# Altium schematic sheet Longboard_32bit.SchDoc: RP2040 CNC
size C; Author: AM; CompanyName: Expatria Technologies; DrawnBy: A.Marles; Engineer: AM; Organization: Expatria Technolgoies; Address1: PO Box 2084; Address3: Merritt, BC V1K 1B8; Address4: Canada; DocumentNumber: 4; SheetNumber: 4; SheetTotal: 26
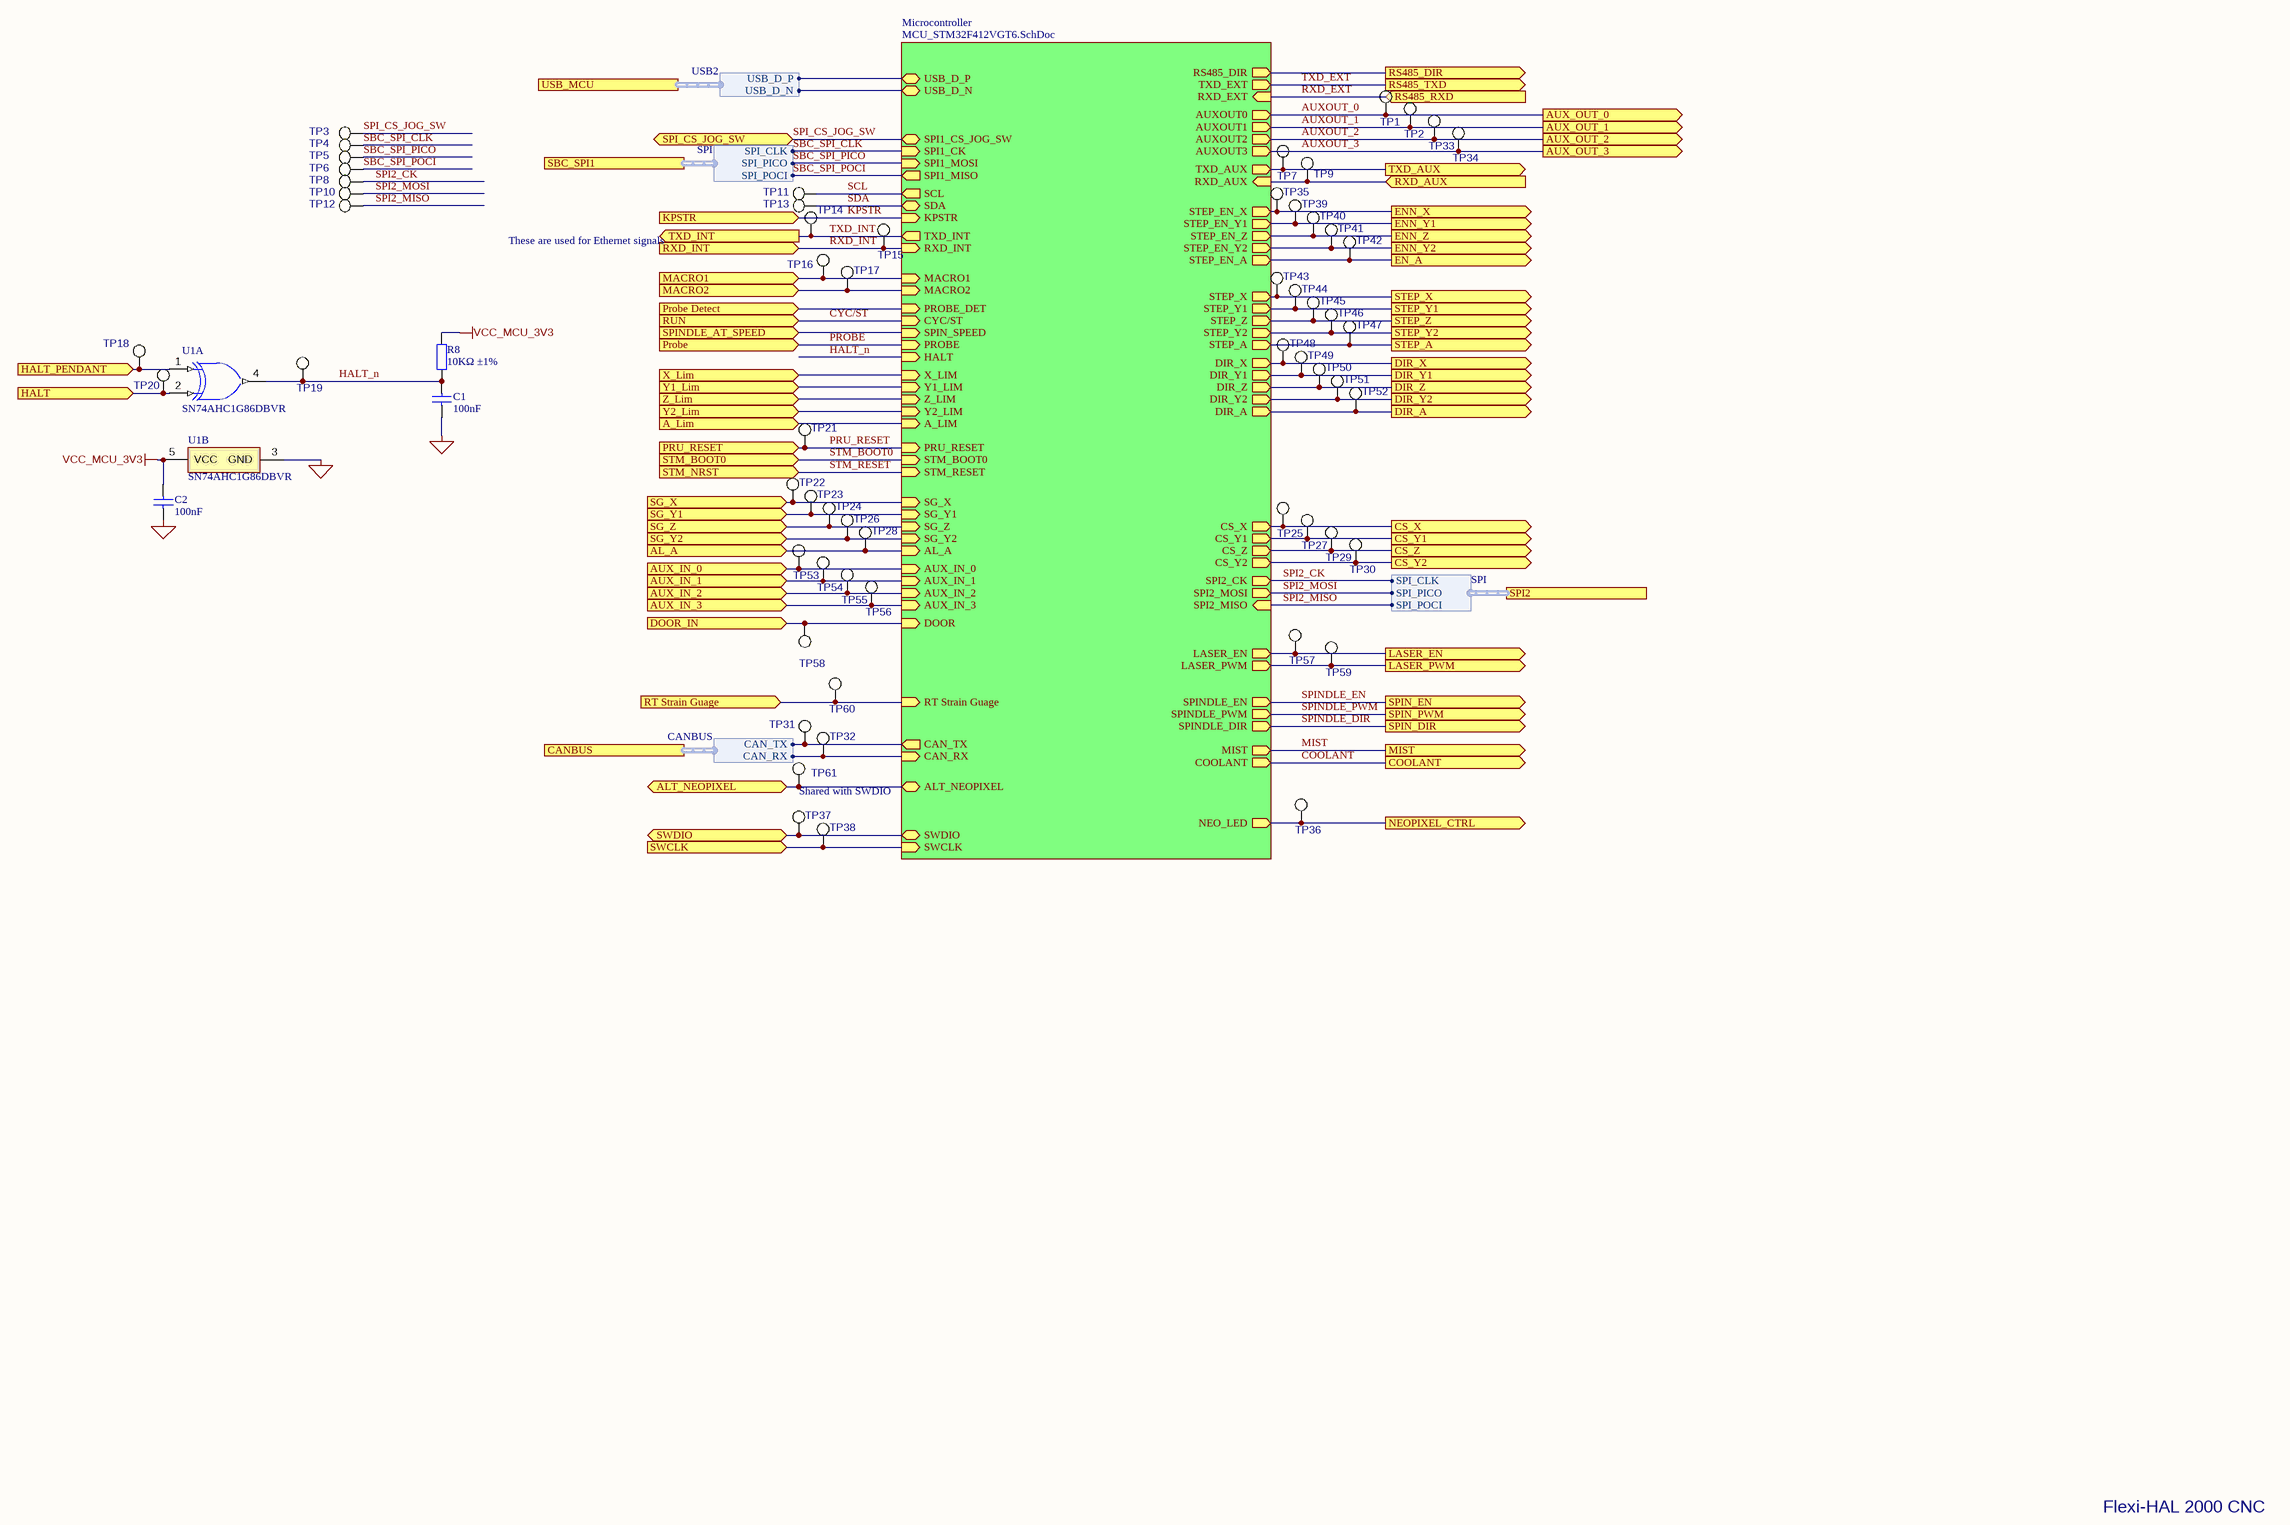
[diagram p0: Longboard_32bit.SchDoc]

## Parts
C1  100nF  [0603_C]
C2  100nF  [0603_C]
R8  10KΩ ±1%  [0603_R]
TP1  TESTPOINT  [TP/SMT]  (value not drawn)  (no BOM)
TP2  TESTPOINT  [TP/SMT]  (value not drawn)  (no BOM)
TP3  TESTPOINT  [TP/SMT]  (value not drawn)  (no BOM)
TP4  TESTPOINT  [TP/SMT]  (value not drawn)  (no BOM)
TP5  TESTPOINT  [TP/SMT]  (value not drawn)  (no BOM)
TP6  TESTPOINT  [TP/SMT]  (value not drawn)  (no BOM)
TP7  TESTPOINT  [TP/SMT]  (value not drawn)  (no BOM)
TP8  TESTPOINT  [TP/SMT]  (value not drawn)  (no BOM)
TP9  TESTPOINT  [TP/SMT]  (value not drawn)  (no BOM)
TP10  TESTPOINT  [TP/SMT]  (value not drawn)  (no BOM)
TP11  TESTPOINT  [TP/SMT]  (value not drawn)  (no BOM)
TP12  TESTPOINT  [TP/SMT]  (value not drawn)  (no BOM)
TP13  TESTPOINT  [TP/SMT]  (value not drawn)  (no BOM)
TP14  TESTPOINT  [TP/SMT]  (value not drawn)  (no BOM)
TP15  TESTPOINT  [TP/SMT]  (value not drawn)  (no BOM)
TP16  TESTPOINT  [TP/SMT]  (value not drawn)  (no BOM)
TP17  TESTPOINT  [TP/SMT]  (value not drawn)  (no BOM)
TP18  TESTPOINT  [TP/SMT]  (value not drawn)  (no BOM)
TP19  TESTPOINT  [TP/SMT]  (value not drawn)  (no BOM)
TP20  TESTPOINT  [TP/SMT]  (value not drawn)  (no BOM)
TP21  TESTPOINT  [TP/SMT]  (value not drawn)  (no BOM)
TP22  TESTPOINT  [TP/SMT]  (value not drawn)  (no BOM)
TP23  TESTPOINT  [TP/SMT]  (value not drawn)  (no BOM)
TP24  TESTPOINT  [TP/SMT]  (value not drawn)  (no BOM)
TP25  TESTPOINT  [TP/SMT]  (value not drawn)  (no BOM)
TP26  TESTPOINT  [TP/SMT]  (value not drawn)  (no BOM)
TP27  TESTPOINT  [TP/SMT]  (value not drawn)  (no BOM)
TP28  TESTPOINT  [TP/SMT]  (value not drawn)  (no BOM)
TP29  TESTPOINT  [TP/SMT]  (value not drawn)  (no BOM)
TP30  TESTPOINT  [TP/SMT]  (value not drawn)  (no BOM)
TP31  TESTPOINT  [TP/SMT]  (value not drawn)  (no BOM)
TP32  TESTPOINT  [TP/SMT]  (value not drawn)  (no BOM)
TP33  TESTPOINT  [TP/SMT]  (value not drawn)  (no BOM)
TP34  TESTPOINT  [TP/SMT]  (value not drawn)  (no BOM)
TP35  TESTPOINT  [TP/SMT]  (value not drawn)  (no BOM)
TP36  TESTPOINT  [TP/SMT]  (value not drawn)  (no BOM)
TP37  TESTPOINT  [TP/SMT]  (value not drawn)  (no BOM)
TP38  TESTPOINT  [TP/SMT]  (value not drawn)  (no BOM)
TP39  TESTPOINT  [TP/SMT]  (value not drawn)  (no BOM)
TP40  TESTPOINT  [TP/SMT]  (value not drawn)  (no BOM)
TP41  TESTPOINT  [TP/SMT]  (value not drawn)  (no BOM)
TP42  TESTPOINT  [TP/SMT]  (value not drawn)  (no BOM)
TP43  TESTPOINT  [TP/SMT]  (value not drawn)  (no BOM)
TP44  TESTPOINT  [TP/SMT]  (value not drawn)  (no BOM)
TP45  TESTPOINT  [TP/SMT]  (value not drawn)  (no BOM)
TP46  TESTPOINT  [TP/SMT]  (value not drawn)  (no BOM)
TP47  TESTPOINT  [TP/SMT]  (value not drawn)  (no BOM)
TP48  TESTPOINT  [TP/SMT]  (value not drawn)  (no BOM)
TP49  TESTPOINT  [TP/SMT]  (value not drawn)  (no BOM)
TP50  TESTPOINT  [TP/SMT]  (value not drawn)  (no BOM)
TP51  TESTPOINT  [TP/SMT]  (value not drawn)  (no BOM)
TP52  TESTPOINT  [TP/SMT]  (value not drawn)  (no BOM)
TP53  TESTPOINT  [TP/SMT]  (value not drawn)  (no BOM)
TP54  TESTPOINT  [TP/SMT]  (value not drawn)  (no BOM)
TP55  TESTPOINT  [TP/SMT]  (value not drawn)  (no BOM)
TP56  TESTPOINT  [TP/SMT]  (value not drawn)  (no BOM)
TP57  TESTPOINT  [TP/SMT]  (value not drawn)  (no BOM)
TP58  TESTPOINT  [TP/SMT]  (value not drawn)  (no BOM)
TP59  TESTPOINT  [TP/SMT]  (value not drawn)  (no BOM)
TP60  TESTPOINT  [TP/SMT]  (value not drawn)  (no BOM)
TP61  TESTPOINT  [TP/SMT]  (value not drawn)  (no BOM)
U1  SN74AHC1G86DBVR  [SOT95P280X145-5N]  (parts A,B of 2)

## Sub-sheets
Microcontroller = MCU_STM32F412VGT6.SchDoc: USB_D_P (bidir), DIR_A (out), RXD_INT (in), DIR_Y1 (out), USB_D_N (bidir), DIR_X (out), STEP_A (out), TXD_INT (out), STEP_Y2 (out), SPI1_CK (in), STEP_Z (out), STEP_Y1 (out), SPI1_MISO (out), SPI1_MOSI (in), SPIN_SPEED (in), STEP_X (out), CYC/ST (in), SPI1_CS_JOG_SW (bidir), PROBE (in), AUXOUT3 (out), TXD_EXT (out), SDA (bidir), AUXOUT2 (out), AUXOUT0 (out), Y2_LIM (in), SCL (out), DIR_Z (out), KPSTR (in), RXD_EXT (in), HALT (in), AUXOUT1 (out), DIR_Y2 (out), PRU_RESET (in), X_LIM (in), Z_LIM (in), STM_BOOT0 (in), Y1_LIM (in), STEP_EN_X (out), A_LIM (in), STM_RESET (in), STEP_EN_Y1 (out), SPI2_CK (out), SPI2_MISO (in), SPI2_MOSI (out), LASER_PWM (out), LASER_EN (out), SPINDLE_PWM (out), SPINDLE_DIR (out), SPINDLE_EN (out), STEP_EN_Z (out), STEP_EN_Y2 (out), STEP_EN_A (out), SG_Y2 (in), SG_Z (in), SG_Y1 (in), SG_X (in), AL_A (in), MIST (out), COOLANT (out), CS_X (out), CS_Y1 (out), CS_Z (out), CS_Y2 (out), AUX_IN_0 (in), MACRO1 (in), MACRO2 (in), AUX_IN_1 (in), AUX_IN_2 (in), AUX_IN_3 (in), PROBE_DET (in), RS485_DIR (out), NEO_LED (out), RT Strain Guage (in), CAN_TX (out), CAN_RX (in), SWCLK (in), SWDIO (bidir), RXD_AUX (in), TXD_AUX (out), DOOR (in), ALT_NEOPIXEL (bidir)

## Ports
A_Lim (in), AL_A (in), ALT_NEOPIXEL (bidir), AUX_IN_0 (in), AUX_IN_1 (in), AUX_IN_2 (in), AUX_IN_3 (in), AUX_OUT_0 (out), AUX_OUT_1 (out), AUX_OUT_2 (out), AUX_OUT_3 (out), CANBUS (harness CANBUS), COOLANT (out), CS_X (out), CS_Y1 (out), CS_Y2 (out), CS_Z (out), DIR_A (out), DIR_X (out), DIR_Y1 (out), DIR_Y2 (out), DIR_Z (out), DOOR_IN (in), EN_A (out), ENN_X (out), ENN_Y1 (out), ENN_Y2 (out), ENN_Z (out), HALT (in), HALT_PENDANT (in), KPSTR (in), LASER_EN (out), LASER_PWM (out), MACRO1 (in), MACRO2 (in), MIST (out), NEOPIXEL_CTRL (out), Probe (in), Probe Detect (in), PRU_RESET (in), RS485_DIR (out), RS485_RXD (in), RS485_TXD (out), RT Strain Guage (in), RUN (in), RXD_AUX (in), RXD_INT (in), SBC_SPI1 (harness SPI), SG_X (in), SG_Y1 (in), SG_Y2 (in), SG_Z (in), SPI2 (harness SPI), SPI_CS_JOG_SW (bidir), SPIN_DIR (out), SPIN_EN (out), SPIN_PWM (out), SPINDLE_AT_SPEED (in), STEP_A (out), STEP_X (out), STEP_Y1 (out), STEP_Y2 (out), STEP_Z (out), STM_BOOT0 (in), STM_NRST (in), SWCLK (in), SWDIO (bidir), TXD_AUX (out), TXD_INT (out), USB_MCU (harness USB2), X_Lim (in), Y1_Lim (in), Y2_Lim (in), Z_Lim (in)

## Harnesses
SPI: SPI_CLK, SPI_PICO, SPI_POCI
USB2: USB_D_P, USB_D_N
CANBUS: CAN_TX, CAN_RX

## Nets
MCU_GND: C1.1 C2.1 U1.3(GND)
VCC_MCU_3V3: C2.2 R8.2 U1.5(VCC)
A_Lim: port A_Lim, sheet Microcontroller/A_LIM
AL_A: TP28.1 ; port AL_A, sheet Microcontroller/AL_A
ALT_NEOPIXEL: TP61.1 ; port ALT_NEOPIXEL, sheet Microcontroller/ALT_NEOPIXEL
AUX_IN_0: TP53.1 ; port AUX_IN_0, sheet Microcontroller/AUX_IN_0
AUX_IN_1: TP54.1 ; port AUX_IN_1, sheet Microcontroller/AUX_IN_1
AUX_IN_2: TP55.1 ; port AUX_IN_2, sheet Microcontroller/AUX_IN_2
AUX_IN_3: TP56.1 ; port AUX_IN_3, sheet Microcontroller/AUX_IN_3
AUXOUT_0: TP1.1 ; port AUX_OUT_0, sheet Microcontroller/AUXOUT0
AUXOUT_1: TP2.1 ; port AUX_OUT_1, sheet Microcontroller/AUXOUT1
AUXOUT_2: TP33.1 ; port AUX_OUT_2, sheet Microcontroller/AUXOUT2
AUXOUT_3: TP34.1 ; port AUX_OUT_3, sheet Microcontroller/AUXOUT3
COOLANT: port COOLANT, sheet Microcontroller/COOLANT
CS_X: TP25.1 ; port CS_X, sheet Microcontroller/CS_X
CS_Y1: TP27.1 ; port CS_Y1, sheet Microcontroller/CS_Y1
CS_Y2: TP30.1 ; port CS_Y2, sheet Microcontroller/CS_Y2
CS_Z: TP29.1 ; port CS_Z, sheet Microcontroller/CS_Z
CYC/ST: port RUN, sheet Microcontroller/CYC/ST
DIR_A: TP52.1 ; port DIR_A, sheet Microcontroller/DIR_A
DIR_X: TP48.1 ; port DIR_X, sheet Microcontroller/DIR_X
DIR_Y1: TP49.1 ; port DIR_Y1, sheet Microcontroller/DIR_Y1
DIR_Y2: TP51.1 ; port DIR_Y2, sheet Microcontroller/DIR_Y2
DIR_Z: TP50.1 ; port DIR_Z, sheet Microcontroller/DIR_Z
DOOR_IN: TP58.1 ; port DOOR_IN, sheet Microcontroller/DOOR
EN_A: TP42.1 ; port EN_A, sheet Microcontroller/STEP_EN_A
ENN_X: TP35.1 ; port ENN_X, sheet Microcontroller/STEP_EN_X
ENN_Y1: TP39.1 ; port ENN_Y1, sheet Microcontroller/STEP_EN_Y1
ENN_Y2: TP41.1 ; port ENN_Y2, sheet Microcontroller/STEP_EN_Y2
ENN_Z: TP40.1 ; port ENN_Z, sheet Microcontroller/STEP_EN_Z
HALT: TP20.1 U1.2(B) ; port HALT
HALT_n: C1.2 R8.1 TP19.1 U1.4(Y) ; sheet Microcontroller/HALT
HALT_PENDANT: TP18.1 U1.1(A) ; port HALT_PENDANT
KPSTR: port KPSTR, sheet Microcontroller/KPSTR
LASER_EN: TP57.1 ; port LASER_EN, sheet Microcontroller/LASER_EN
LASER_PWM: TP59.1 ; port LASER_PWM, sheet Microcontroller/LASER_PWM
MACRO1: TP16.1 ; port MACRO1, sheet Microcontroller/MACRO1
MACRO2: TP17.1 ; port MACRO2, sheet Microcontroller/MACRO2
MIST: port MIST, sheet Microcontroller/MIST
NEOPIXEL_CTRL: TP36.1 ; port NEOPIXEL_CTRL, sheet Microcontroller/NEO_LED
PROBE: port Probe, sheet Microcontroller/PROBE
Probe Detect: port Probe Detect, sheet Microcontroller/PROBE_DET
PRU_RESET: TP21.1 ; port PRU_RESET, sheet Microcontroller/PRU_RESET
RS485_DIR: port RS485_DIR, sheet Microcontroller/RS485_DIR
RT Strain Guage: TP60.1 ; port RT Strain Guage, sheet Microcontroller/RT Strain Guage
RXD_AUX: TP9.1 ; port RXD_AUX, sheet Microcontroller/RXD_AUX
RXD_EXT: port RS485_RXD, sheet Microcontroller/RXD_EXT
RXD_INT: TP15.1 ; port RXD_INT, sheet Microcontroller/RXD_INT
SBC_SPI_CLK: TP4.1 ; sheet Microcontroller/SPI1_CK, port SBC_SPI1.SPI_CLK
SBC_SPI_PICO: TP5.1 ; sheet Microcontroller/SPI1_MOSI, port SBC_SPI1.SPI_PICO
SBC_SPI_POCI: TP6.1 ; sheet Microcontroller/SPI1_MISO, port SBC_SPI1.SPI_POCI
SCL: TP11.1 ; sheet Microcontroller/SCL
SDA: TP13.1 ; sheet Microcontroller/SDA
SG_X: TP22.1 ; port SG_X, sheet Microcontroller/SG_X
SG_Y1: TP23.1 ; port SG_Y1, sheet Microcontroller/SG_Y1
SG_Y2: TP26.1 ; port SG_Y2, sheet Microcontroller/SG_Y2
SG_Z: TP24.1 ; port SG_Z, sheet Microcontroller/SG_Z
SPI2_CK: TP8.1 ; sheet Microcontroller/SPI2_CK, port SPI2.SPI_CLK
SPI2_MISO: TP12.1 ; sheet Microcontroller/SPI2_MISO, port SPI2.SPI_POCI
SPI2_MOSI: TP10.1 ; sheet Microcontroller/SPI2_MOSI, port SPI2.SPI_PICO
SPI_CS_JOG_SW: TP3.1 ; port SPI_CS_JOG_SW, sheet Microcontroller/SPI1_CS_JOG_SW
SPINDLE_AT_SPEED: port SPINDLE_AT_SPEED, sheet Microcontroller/SPIN_SPEED
SPINDLE_DIR: port SPIN_DIR, sheet Microcontroller/SPINDLE_DIR
SPINDLE_EN: port SPIN_EN, sheet Microcontroller/SPINDLE_EN
SPINDLE_PWM: port SPIN_PWM, sheet Microcontroller/SPINDLE_PWM
STEP_A: TP47.1 ; port STEP_A, sheet Microcontroller/STEP_A
STEP_X: TP43.1 ; port STEP_X, sheet Microcontroller/STEP_X
STEP_Y1: TP44.1 ; port STEP_Y1, sheet Microcontroller/STEP_Y1
STEP_Y2: TP46.1 ; port STEP_Y2, sheet Microcontroller/STEP_Y2
STEP_Z: TP45.1 ; port STEP_Z, sheet Microcontroller/STEP_Z
STM_BOOT0: port STM_BOOT0, sheet Microcontroller/STM_BOOT0
STM_RESET: port STM_NRST, sheet Microcontroller/STM_RESET
SWCLK: TP38.1 ; port SWCLK, sheet Microcontroller/SWCLK
SWDIO: TP37.1 ; port SWDIO, sheet Microcontroller/SWDIO
TXD_AUX: TP7.1 ; port TXD_AUX, sheet Microcontroller/TXD_AUX
TXD_EXT: port RS485_TXD, sheet Microcontroller/TXD_EXT
TXD_INT: TP14.1 ; port TXD_INT, sheet Microcontroller/TXD_INT
X_Lim: port X_Lim, sheet Microcontroller/X_LIM
Y1_Lim: port Y1_Lim, sheet Microcontroller/Y1_LIM
Y2_Lim: port Y2_Lim, sheet Microcontroller/Y2_LIM
Z_Lim: port Z_Lim, sheet Microcontroller/Z_LIM
NetTP31_1: TP31.1 ; sheet Microcontroller/CAN_TX, port CANBUS.CAN_TX
NetTP32_1: TP32.1 ; sheet Microcontroller/CAN_RX, port CANBUS.CAN_RX
(unnamed): sheet Microcontroller/USB_D_P, port USB_MCU.USB_D_P
(unnamed): sheet Microcontroller/USB_D_N, port USB_MCU.USB_D_N

## Notes on the sheet
- These are used for Ethernet signals
- (near TP61) Shared with SWDIO
- Flexi-HAL 2000 CNC
- Expatria Technologies
- SHEET
- PROJECT
- REV
- EMAIL: INFO@EXPATRIA.CA
- 625 Kane Valley Rd.
- Box 2084
- Merritt, BC V1K1B8
- SIZE
- ENGR
- C
- MODIFIED
- DOCUMENT
- /
- Copyright Expatria Technologies 2024. This document describes Open Hardware and is licensed under the CERN-OHL-S v2. No warranty is implied or expressed.

## Library data of the parts
C1 C2 = 0603 100nF (104) 10% 50V: 50V 100nF X7R ±10% 0603 Multilayer Ceramic Capacitors MLCC - SMD/SMT ROHS; Manufacturer: YAGEO; Manufacturer Part Number: CC0603KRX7R9BB104; ComponentLink1Description: Supplier link; ComponentLink1URL: http://www.szlcsc.com/product/details_15331.html; Package: 0603; Supplier: LC; SuppliersPartNumber: C14663; Capacitance: 100nF; Tolerance: 10%; Voltage: 50V
R8 = 0603 10K (1002) 1%: Chip resistor; Manufacturer: Uniroyal Elec; Manufacturer Part Number: 0603WAF1002T5E; Power: 1/10W; ComponentLink1Description: Supplier link; ComponentLink1URL: http://www.szlcsc.com/product/details_26547.html; Package: 0603; Supplier: LCSC; SuppliersPartNumber: C25804; Resistance: 10KΩ; Tolerance: 1%
TP1-TP61 = TESTPOINT: Test Point; Manufacturer 1: N/A; Manufacturer Part Number 1: N/A; Value: Testpoint; Manufacturer: N/A; Manufacturer Part Number: N/A
U1 = SN74AHC1G86DBVR: XOR (Exclusive OR) IC 1 Channel  SOT-23-5; Manufacturer: Texas Instruments; Input Type: CMOS; Sub-Family: XOR Gate; Logic: True; F @ Nom Voltage(Max)(Mhz): 75; Schmitt Trigger: No; VCC(Min)(V): 2; Bits(#): 1; Voltage(Nom)(V): 3.3,5; VCC(Max)(V): 5.5; Rating: Catalog; ICC @ Nom Voltage(Max)(mA): 0.01; tpd @ Nom Voltage(Max)(ns): 14.5,8.8; Output Drive (IOL/IOH)(Max)(mA): 50/-50; Technology Family: AHC; Logic Function: XOR GATE,OR GATE; Propagation Delay: 10ns; Max Supply Voltage: 5.5V; Min Supply Voltage: 2V; Quiescent Current: 1uA; High Level Output Current: -8mA; Low Level Output Current: 8mA; Turn-On Delay Time: 14.5ns; DatasheetVersion: SCLS323N; Generic Part Number: SN74AHC1G86; Output Type: CMOS; PackageReference: DBV0005A; Gate Type: XOR; Operating Temperature Range(C): -40 to 125; 3-State Output: No; Manufacturer Part Number: SN74AHC1G86DBVR; Supplier 1: LCSC; Supplier Part Number 1: C7471; RoHS: Yes; Category: Logic Gates; Stock 1: 2465; Pricing 1: 5=0.121800, 50=0.098100, 150=0.086300, 500=0.077400, 3000=0.064100, 6000=0.060900 (USD); Mount: Surface Mount; Case/Package: SOT-23-5; Number of Pins: 5; Weight: 0.000557oz; Contact Plating: Tin,Matte; Min Operating Temperature: -40°C; Max Operating Temperature: 125°C; Number of Elements: 1; Number of Inputs: 2; Package Quantity: 3000; Packaging: Tape and Reel; Number of Circuits: 1; Number of Gates: 1; Number of Bits: 1; Series: 74AHC; Technology: CMOS; Number of Outputs: 1; Number of Input Lines: 2; Number of Output Lines: 1; Schmitt Trigger Input: No; Max Output Current: 8mA; Output Current: 8mA; Termination: SMD/SMT; Length: 2.9mm; Width: 1.6mm; Height: 1.15mm; Radiation Hardening: No; Lead Free: Lead Free; RoHS Compliant: Yes; Reach SVHC Compliant: Yes; ComponentLink1URL: https://datasheet.ciiva.com/7783/1767166-7783573.pdf?src-supplier=Element14; ComponentLink1Description: https://datasheet.ciiva.com/7783/1767166-7783573.pdf?src-supplier=Element14; ComponentLink2URL: https://datasheet.ciiva.com/14134/sn74ahc1g86-eng-tds-14134938.pdf?src-supplier=Distrelec; ComponentLink2Description: https://datasheet.ciiva.com/14134/sn74ahc1g86-eng-tds-14134938.pdf?src-supplier=Distrelec; ComponentLink3URL: https://datasheet.ciiva.com/46393/1882824-46393978.pdf?src-supplier=Element14; ComponentLink3Description: https://datasheet.ciiva.com/46393/1882824-46393978.pdf?src-supplier=Element14; ComponentLink4URL: https://datasheet.ciiva.com/1864/sn74ahc1g86-1864486.pdf?src-supplier=Digi-Key; ComponentLink4Description: https://datasheet.ciiva.com/1864/sn74ahc1g86-1864486.pdf?src-supplier=Digi-Key; ComponentLink5URL: https://datasheet.ciiva.com/1864/sn74ahc1g86-1864485.pdf?src-supplier=Digi-Key; ComponentLink5Description: https://datasheet.ciiva.com/1864/sn74ahc1g86-1864485.pdf?src-supplier=Digi-Key; ComponentLink6URL: https://datasheet.ciiva.com/1864/sn74ahc1g86-1864487.pdf?src-supplier=Digi-Key; ComponentLink6Description: https://datasheet.ciiva.com/1864/sn74ahc1g86-1864487.pdf?src-supplier=Digi-Key; ComponentLink7URL: https://datasheet.ciiva.com/14290/sn74ahc1g86-14290566.pdf?src-supplier=Avnet; ComponentLink7Description: https://datasheet.ciiva.com/14290/sn74ahc1g86-14290566.pdf?src-supplier=Avnet; ComponentLink8URL: https://datasheet.ciiva.com/15221/getdatasheetpartid-214959-15221947.pdf?src-supplier=Verical; ComponentLink8Description: https://datasheet.ciiva.com/15221/getdatasheetpartid-214959-15221947.pdf?src-supplier=Verical; ComponentLink9URL: https://datasheet.ciiva.com/14291/sn74ahc1g86-14291126.pdf?src-supplier=Avnet; ComponentLink9Description: https://datasheet.ciiva.com/14291/sn74ahc1g86-14291126.pdf?src-supplier=Avnet; ComponentLink10URL: https://datasheet.ciiva.com/48703/001074497-da-01-en-ic-sgl-2in-sn74ahc1g86dbvr-sot-23-5-tid-48703788.pdf?src-supplier=Conrad; ComponentLink10Description: https://datasheet.ciiva.com/48703/001074497-da-01-en-ic-sgl-2in-sn74ahc1g86dbvr-sot-23-5-tid-48703788.pdf?src-supplier=Conrad; SuppliersPartNumber: C7471; Supplier: LCSC